# Altium schematic sheet 固定端V1.1.SchDoc
size A4
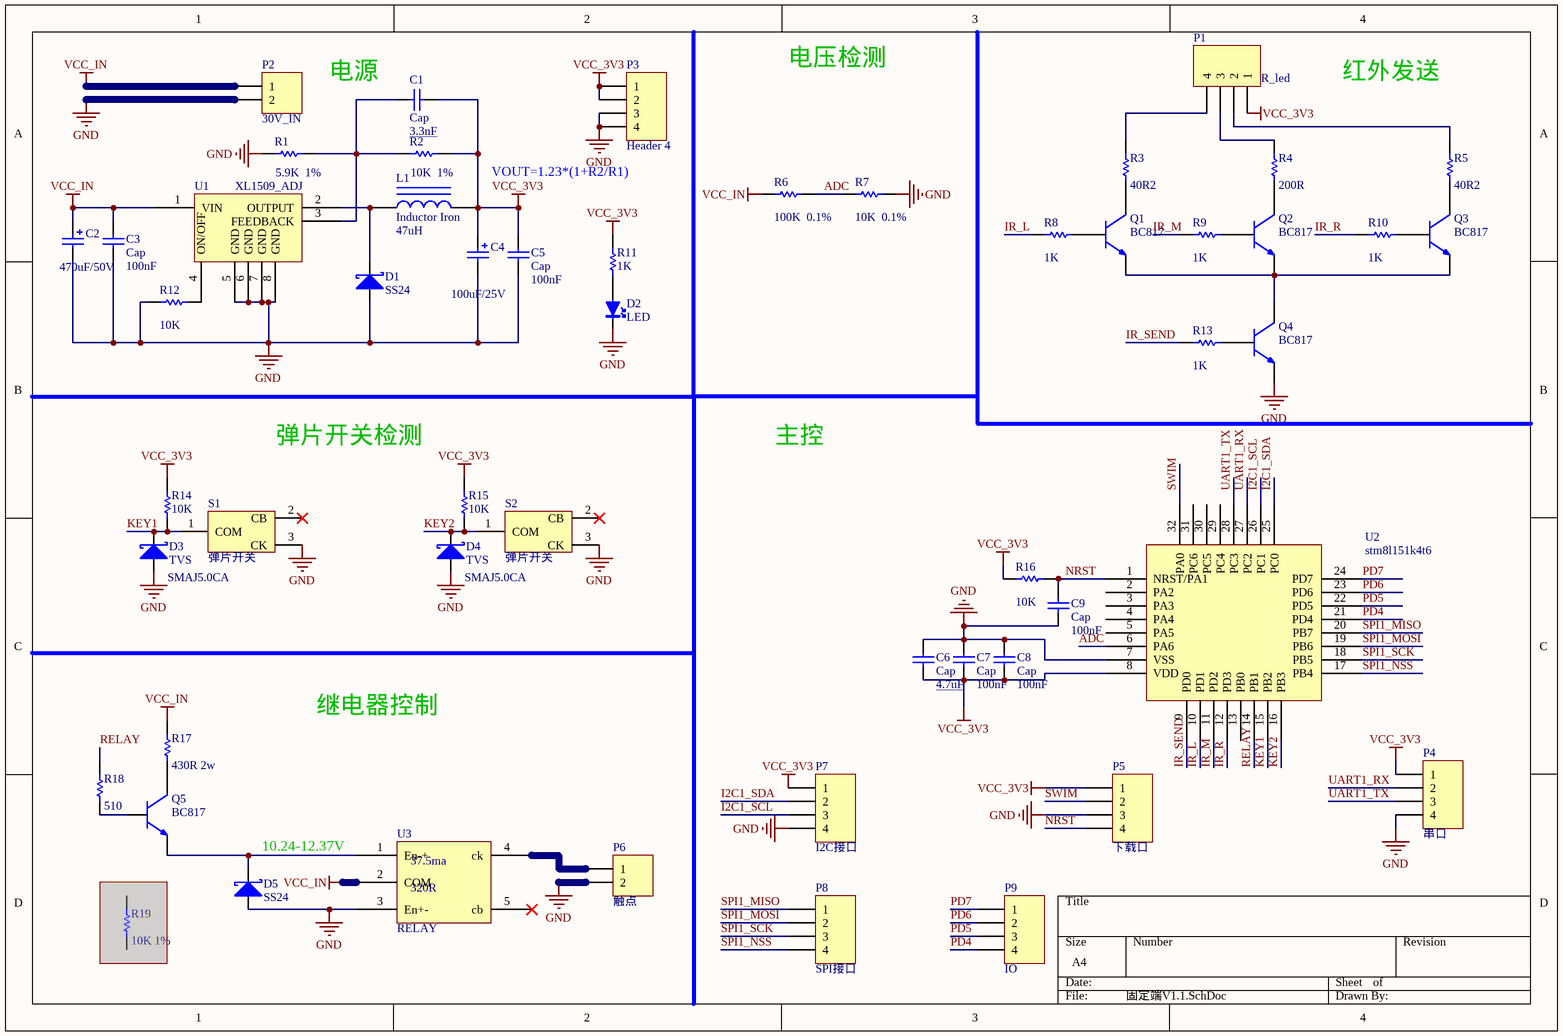
[diagram p0: 固定端V1.1.SchDoc]

## Parts
C1  Cap  value 3.3nF  [C0603]
C2  value 470uF/50V  [CTH-R5-D5]  (hidden comment: Cap Pol1)
C3  Cap  value 100nF  [C0603]
C4  value 100uF/25V  [CTH-R3-D2.54]  (hidden comment: Cap Pol1)
C5  Cap  value 100nF  [C0603]
C6  Cap  value 4.7uF  [C0805]
C7  Cap  value 100nF  [C0603]
C8  Cap  value 100nF  [C0603]
C9  Cap  value 100nF  [C0603]
D1  value SS24  [D-SMA]  (hidden comment: Diode-Schottky)
D2  LED  [LED0805]
D3  TVS  value SMAJ5.0CA  [D-SMA]
D4  TVS  value SMAJ5.0CA  [D-SMA]
D5  value SS24  [D-SMA]  (hidden comment: Diode-Schottky)
L1  Inductor Iron  value 47uH  [L-SMT-7257]
P1  R_led  [XH2.54-4P]
P2  30V_IN  [KF103-2p-5.08mm]
P3  Header 4  [HDR1X4]
P4  串口  [XH2.54-4P]
P5  下载口  [HDR1X4]
P6  触点  [KF103-2p-5.08mm]
P7  I2C接口  [HDR1X4]
P8  SPI接口  [HDR1X4]
P9  IO  [HDR1X4]
Q1  BC817  [SOT23-3]
Q2  BC817  [SOT23-3]
Q3  BC817  [SOT23-3]
Q4  BC817  [SOT23-3]
Q5  BC817  [SOT23-3]
R1  value 5.9K  1%  [R0603]  (hidden comment: Res1)
R2  value 10K  1%  [R0603]  (hidden comment: Res1)
R3  value 40R2  [R0603]  (hidden comment: Res1)
R4  value 200R  [R0603]  (hidden comment: Res1)
R5  value 40R2  [R0603]  (hidden comment: Res1)
R6  value 100K  0.1%  [R0603]  (hidden comment: Res1)
R7  value 10K  0.1%  [R0603]  (hidden comment: Res1)
R8  value 1K  [R0603]  (hidden comment: Res1)
R9  value 1K  [R0603]  (hidden comment: Res1)
R10  value 1K  [R0603]  (hidden comment: Res1)
R11  value 1K  [R0603]  (hidden comment: Res1)
R12  value 10K  [R0603]  (hidden comment: Res1)
R13  value 1K  [R0603]  (hidden comment: Res1)
R14  value 10K  [R0603]  (hidden comment: Res1)
R15  value 10K  [R0603]  (hidden comment: Res1)
R16  value 10K  [R0603]  (hidden comment: Res1)
R17  value 430R 2w  [AXIAL-0.4]  (hidden comment: Res1)
R18  value 510  [R0603]  (hidden comment: Res1)
R19  value 10K 1%  [AXIAL-0.4]  (hidden comment: Res1)  (masked out: inside a compile mask, not in the netlist)
S1  弹片开关  [SW_limit_3pin]
S2  弹片开关  [SW_limit_3pin]
U1  XL1509_ADJ  [SOP8]
U2  stm8l151k4t6  [qfp32-32-0909a]
U3  RELAY  [relay-12v-5PIN]

## Nets
GND: C2.2 C3.1 C4.2 C5.1 C6.2 C7.2 C8.2 C9.1 D1.1(A) D2.2(K) D3.1(A) D4.1(A) D5.1(A) P2.2 P3.3 P3.4 P4.4 P5.3 P6.2 P7.4 Q4.2(E) R1.1 R7.2 R12.2 S1.3(CK) S2.3(CK) U1.5(GND) U1.6(GND) U1.7(GND) U1.8(GND) U2.7(VSS) U3.3(En+-)
VCC_3V3: C1.1 C4.1 C5.2 C6.1 C7.1 C8.1 L1.2 P1.1 P3.1 P3.2 P4.1 P5.1 P7.1 R2.2 R11.1 R14.2 R15.2 R16.1 U2.8(VDD)
VCC_IN: C2.1 C3.2 P2.1 R6.1 R17.1 U1.1(VIN) U3.2(COM)
ADC: R6.2 R7.1 U2.6(PA6)
I2C1_SCL: P7.3 U2.26(PC1)
I2C1_SDA: P7.2 U2.25(PC0)
IR_L: R8.1 U2.10(PD1)
IR_M: R9.1 U2.11(PD2)
IR_R: R10.1 U2.12(PD3)
IR_SEND: R13.1 U2.9(PD0)
KEY1: D3.2(K) R14.1 S1.1(COM) U2.15(PB2)
KEY2: D4.2(K) R15.1 S2.1(COM) U2.16(PB3)
NRST: C9.2 P5.4 R16.2 U2.1(NRST/PA1)
PD4: P9.4 U2.21(PD4)
PD5: P9.3 U2.22(PD5)
PD6: P9.2 U2.23(PD6)
PD7: P9.1 U2.24(PD7)
RELAY: R18.1 U2.14(PB1)
SPI1_MISO: P8.1 U2.20(PB7)
SPI1_MOSI: P8.2 U2.19(PB6)
SPI1_NSS: P8.4 U2.17(PB4)
SPI1_SCK: P8.3 U2.18(PB5)
SWIM: P5.2 U2.32(PA0)
UART1_RX: P4.2 U2.27(PC2)
UART1_TX: P4.3 U2.28(PC3)
NetC1_2: C1.2 R1.2 R2.1 U1.3(FEEDBACK)
NetD1_2: D1.2(K) L1.1 U1.2(OUTPUT)
NetD2_1: D2.1(A) R11.2
NetD5_2: D5.2(K) Q5.2(E) U3.1(En-+)
NetP1_2: P1.2 R5.2
NetP1_3: P1.3 R4.2
NetP1_4: P1.4 R3.2
NetP6_1: P6.1 U3.4(ck)
NetQ1_1: Q1.1(B) R8.2
NetQ1_2: Q1.2(E) Q2.2(E) Q3.2(E) Q4.3(C)
NetQ1_3: Q1.3(C) R3.1
NetQ2_1: Q2.1(B) R9.2
NetQ2_3: Q2.3(C) R4.1
NetQ3_1: Q3.1(B) R10.2
NetQ3_3: Q3.3(C) R5.1
NetQ4_1: Q4.1(B) R13.2
NetQ5_1: Q5.1(B) R18.2
NetQ5_3: Q5.3(C) R17.2
NetR12_1: R12.1 U1.4(ON/OFF)

Not connected (* = marked no-connect by the designer): S1 2(CB)*; S2 2(CB)*; U2 2(PA2) 3(PA3) 4(PA4) 5(PA5) 13(PB0) 29(PC4) 30(PC5) 31(PC6); U3 5(cb)*

## Notes on the sheet
- 电源
- 电压检测
- 红外发送
- VOUT=1.23*(1+R2/R1)
- 弹片开关检测
- 主控
- 继电器控制
- 10.24-12.37V
- (near U3) 320R
- (near U3) 37.5ma

## Library data of the parts
C1 C3 C5-C9 = Cap: Capacitor; Published: 8-Jun-2000; LatestRevisionDate: 17-Jul-2002; LatestRevisionNote: Re-released for DXP Platform.; PackageReference: RAD-0.3; Publisher: Altium Limited; PackageDescription: Radial Cap, Thru-Hole; 2 Leads; 0.3 in Pin Spacing
C2 C4 = Cap Pol1: Polarized Capacitor (Radial); Published: 8-Jun-2000; LatestRevisionDate: 17-Jul-2002; LatestRevisionNote: Re-released for DXP Platform.; PackageReference: RB7.6-15; Publisher: Altium Limited; PackageDescription: Polarized Capacitor (Radial); 2 Leads
D1 D5 = Diode-Schottky: 肖特基二极管; Published: 8-Jun-2000; LatestRevisionDate: 17-Jul-2002; LatestRevisionNote: Re-released for DXP Platform.; PackageReference: SMB; Publisher: Altium Limited; Code_JEDEC: DO-214-AA
D2 = LED: Value: LED0805绿色
D3 D4 = Diode-TVS: tvs瞬态抑制二极管
L1 = Inductor Iron: Magnetic-Core Inductor; Published: 24-Mar-1999; LatestRevisionDate: 17-Jul-2002; LatestRevisionNote: Re-released for DXP Platform.; PackageReference: AXIAL-0.9; Publisher: Altium Limited; PackageDescription: Axial Device, Thru-Hole; 2 Leads; 0.9 in Pin Spacing
P1 = Header 4: Header, 4-Pin; Value: XH2.54-4; LatestRevisionDate: 17-Jul-2002; LatestRevisionNote: Re-released for DXP Platform.; Publisher: Altium Limited
P2 P6 = Header 2: Header, 2-Pin; Value: kf103-5.08-2p; LatestRevisionDate: 17-Jul-2002; LatestRevisionNote: Re-released for DXP Platform.; Publisher: Altium Limited
P3 = Header 4: Header, 4-Pin; LatestRevisionDate: 17-Jul-2002; LatestRevisionNote: Re-released for DXP Platform.; Publisher: Altium Limited
P4 = H4: HEADER-4; Value: XH2.54-4
P5 = H4: HEADER-4; Value: 2.54mm单排针
P7-P9 = H4: HEADER-4
Q1-Q5 = mNPN: NPN 45V 功耗 310mW; Value: BC817
R1-R19 = Res1: Resistor; Published: 8-Jun-2000; LatestRevisionDate: 17-Jul-2002; LatestRevisionNote: Re-released for DXP Platform.; PackageReference: AXIAL-0.3; Publisher: Altium Limited; PackageDescription: Axial Device, Thru-Hole; 2 Leads; 0.3 in Pin Spacing
S1 S2 = SW_limit_3pin: 3脚弹片限位开关; Value: V-156-1C25
U1 = XL1509: BUCK DCDC; Value: XL1509-ADJ
U3 = relay-5PIN: 5脚12V大功率继电器; Value: JZC-22FFC15DDC12V
U2 = stm8l151k4t6: Value: STM8L151K4T6